# EasyEDA schematic 工训副板（带陀螺仪）_2025-03-23.json
TITLE: Sheet_1; REV: 1.0; Date: 2024-09-17; Sheet: 1/1; Drawn By: iiaazz; Company: Your Company
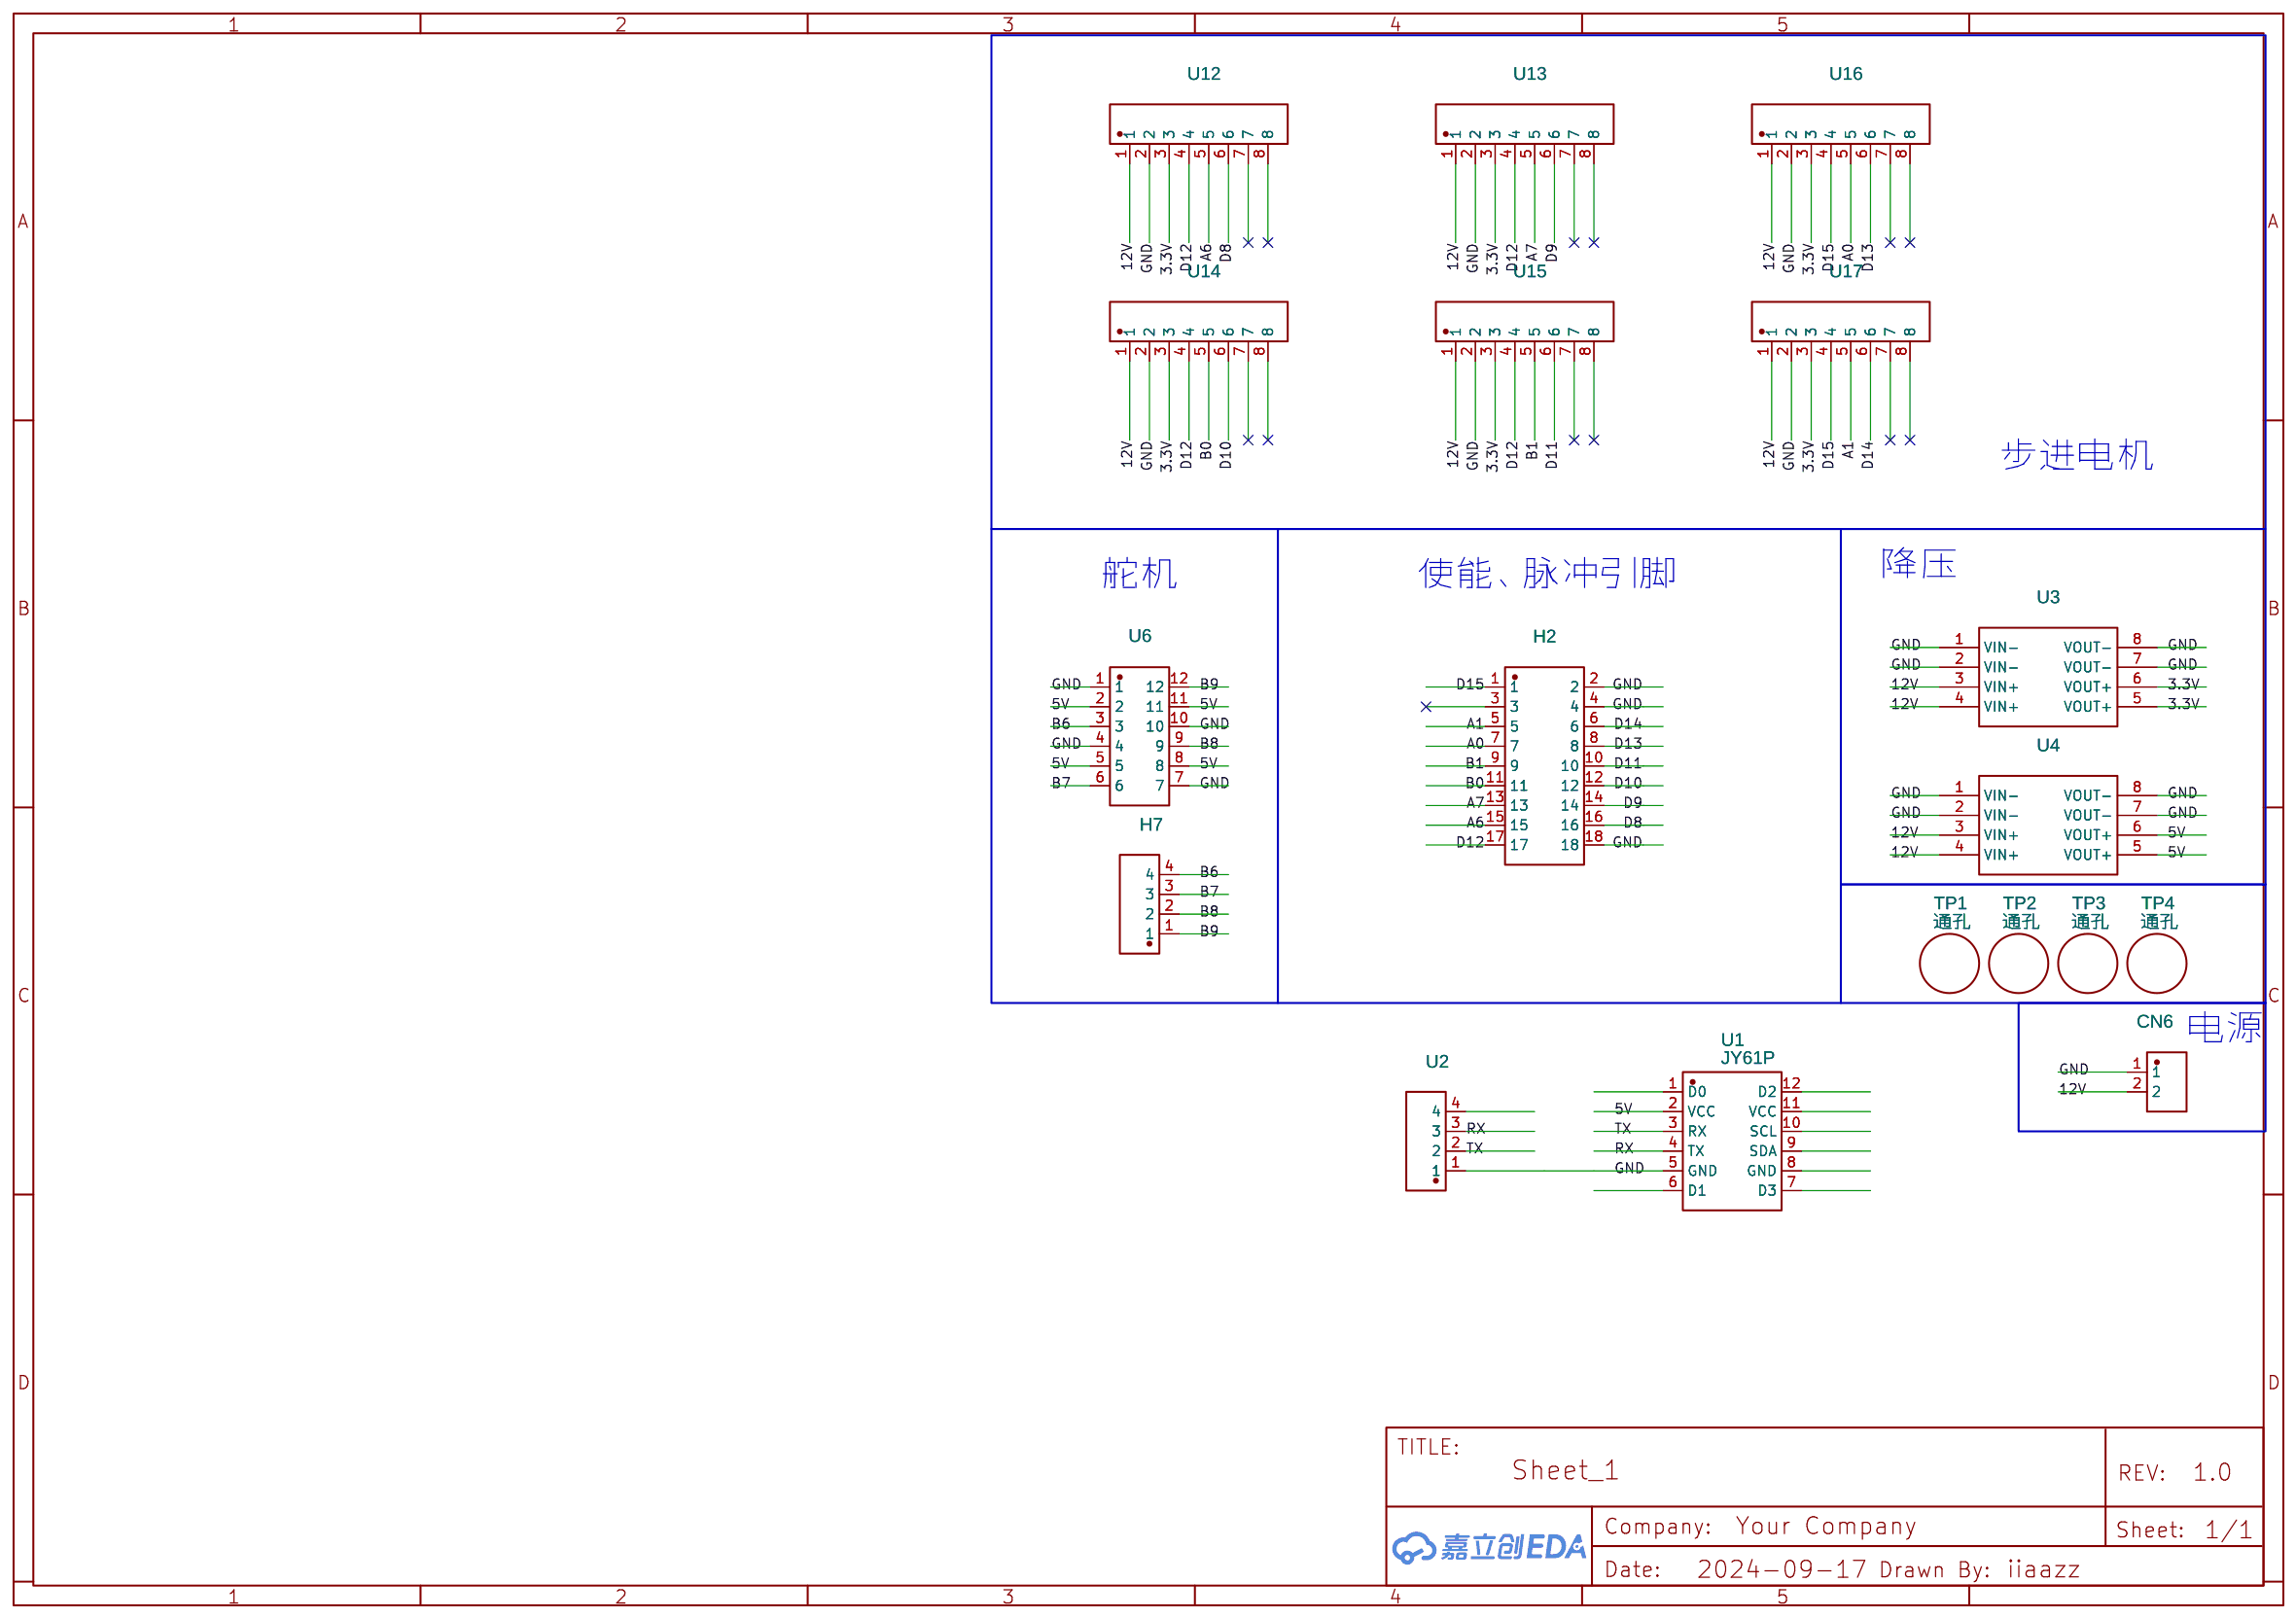
[diagram p0: schematic sheet]

## Parts
CN6  DB2ERC-3.81-2P  [CONN-TH_2P-P3.81_DB2ERC-3.81-2P]
H2  PZ254-2-09-W-8.5  [HDR-TH_18P-P2.54-H-M-R2-C9-S2.54]
H7  PZ254V-11-04P_C2691448  [HDR-TH_4P-P2.54-V-M]
TP1  通孔  [通孔]
TP2  通孔  [通孔]
TP3  通孔  [通孔]
TP4  通孔  [通孔]
U1  JY61P  [JY61P-直插]
U2  XH2.54-4P_C9900011138  [CONN-TH_XH2.54-4P]
U3  MP1584EN  [MP1584EN]
U4  MP1584EN  [MP1584EN]
U6  HX PZ2.54-3X4P ZZ  [HDR-TH_12P-P2.54-V-M-R3-C4-S2.54]
U12  ZX-XH2.54-8PWZ  [CONN-TH_8P-P2.50_ZX-XH2.54-8PWZ]
U13  ZX-XH2.54-8PWZ  [CONN-TH_8P-P2.50_ZX-XH2.54-8PWZ]
U14  ZX-XH2.54-8PWZ  [CONN-TH_8P-P2.50_ZX-XH2.54-8PWZ]
U15  ZX-XH2.54-8PWZ  [CONN-TH_8P-P2.50_ZX-XH2.54-8PWZ]
U16  ZX-XH2.54-8PWZ  [CONN-TH_8P-P2.50_ZX-XH2.54-8PWZ]
U17  ZX-XH2.54-8PWZ  [CONN-TH_8P-P2.50_ZX-XH2.54-8PWZ]

## Library data of the parts
CN6 = DB2ERC-3.81-2P: Contributor: LCSC; Supplier: LCSC; Supplier Part: C395684; Manufacturer: DORABO(地博电气); Manufacturer Part: DB2ERC-3.81-2P-GN; JLCPCB Part Class: Extended Part
H2 = PZ254-2-09-W-8.5: Contributor: LCSC; Supplier: LCSC; Supplier Part: C2894989; Manufacturer: HCTL(华灿天禄); JLCPCB Part Class: Extended Part
H7 = PZ254V-11-04P_C2691448: Contributor: LCSC; Supplier: LCSC; Supplier Part: C2691448; Manufacturer: XFCN(兴飞); Manufacturer Part: PZ254V-11-04P; JLCPCB Part Class: Extended Part
TP1-TP4 = 通孔: Contributor: ssdhtc
U1 = JY61P: Supplier: Wit-Motion; Contributor: XCY.lceda
U2 = XH2.54-4P_C9900011138: Contributor: LCSC; Supplier: LCSC; Supplier Part: C9900011138; Manufacturer: null; Manufacturer Part: XH2.54-4P
U3 U4 = MP1584EN-LF-Z: Contributor: 1234455j
U6 = HX PZ2.54-3X4P ZZ: Supplier: LCSC; Supplier Part: C32713291; Manufacturer: hanxia(韩下); Manufacturer Part: HX PZ2.54-3x4P ZZ; Contributor: lcsc; JLCPCB Part Class: Extended Part; Package Display: No
U12-U17 = ZX-XH2.54-8PWZ: Contributor: lcsc; Supplier: LCSC; Supplier Part: C7429647; Manufacturer: Megastar(兆星); JLCPCB Part Class: Extended Part

## Nets
3.3V: U3.5(VOUT+) U3.6(VOUT+) U12.3 U13.3 U14.3 U15.3 U16.3 U17.3
5V: U1.2(VCC) U4.5(VOUT+) U4.6(VOUT+) U6.2 U6.5 U6.8 U6.11
12V: CN6.2 U3.3(VIN+) U3.4(VIN+) U4.3(VIN+) U4.4(VIN+) U12.1 U13.1 U14.1 U15.1 U16.1 U17.1
GND: CN6.1 H2.2 H2.4 H2.18 U1.5(GND) U2.1 U3.1(VIN-) U3.2(VIN-) U3.7(VOUT-) U3.8(VOUT-) U4.1(VIN-) U4.2(VIN-) U4.7(VOUT-) U4.8(VOUT-) U6.1 U6.4 U6.7 U6.10 U12.2 U13.2 U14.2 U15.2 U16.2 U17.2
A0: H2.7 U16.5
A1: H2.5 U17.5
A6: H2.15 U12.5
A7: H2.13 U13.5
B0: H2.11 U14.5
B1: H2.9 U15.5
B6: H7.4 U6.3
B7: H7.3 U6.6
B8: H7.2 U6.9
B9: H7.1 U6.12
D8: H2.16 U12.6
D9: H2.14 U13.6
D10: H2.12 U14.6
D11: H2.10 U15.6
D12: H2.17 U12.4 U13.4 U14.4 U15.4
D13: H2.8 U16.6
D14: H2.6 U17.6
D15: H2.1 U16.4 U17.4
RX: U1.4(TX) U2.3
TX: U1.3(RX) U2.2

Not connected (* = marked no-connect by the designer): H2 3; U1 1(D0) 6(D1) 7(D3) 8(GND) 9(SDA) 10(SCL) 11(VCC) 12(D2); U2 4; U12 7 8; U13 7 8; U14 7 8; U15 7 8; U16 7 8; U17 7 8

## Notes on the sheet
- 步进电机
- 舵机
- 使能、脉冲引脚
- 降压
- 电源
